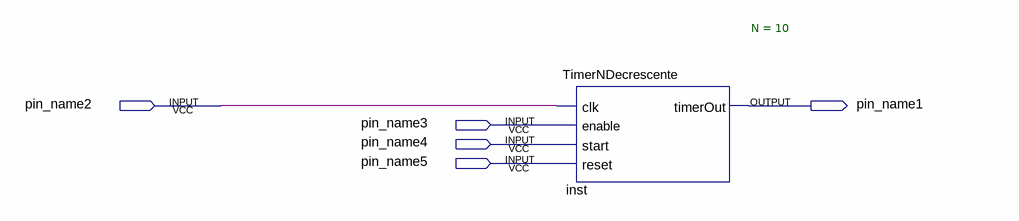
[diagram p0: schematic sheet]
// Quartus schematic Block1.bdf as structural Verilog: 1 symbols, 5 pins
module Block1 (
  input  pin_name2,
  input  pin_name3,
  input  pin_name4,
  input  pin_name5,
  output pin_name1
);

  TimerNDecrescente #(.N(10)) inst (
    .clk(pin_name2), .enable(pin_name3), .start(pin_name4), .reset(pin_name5), .timerOut(pin_name1));
endmodule
